# Altium schematic sheet MCU.SchDoc
size A4
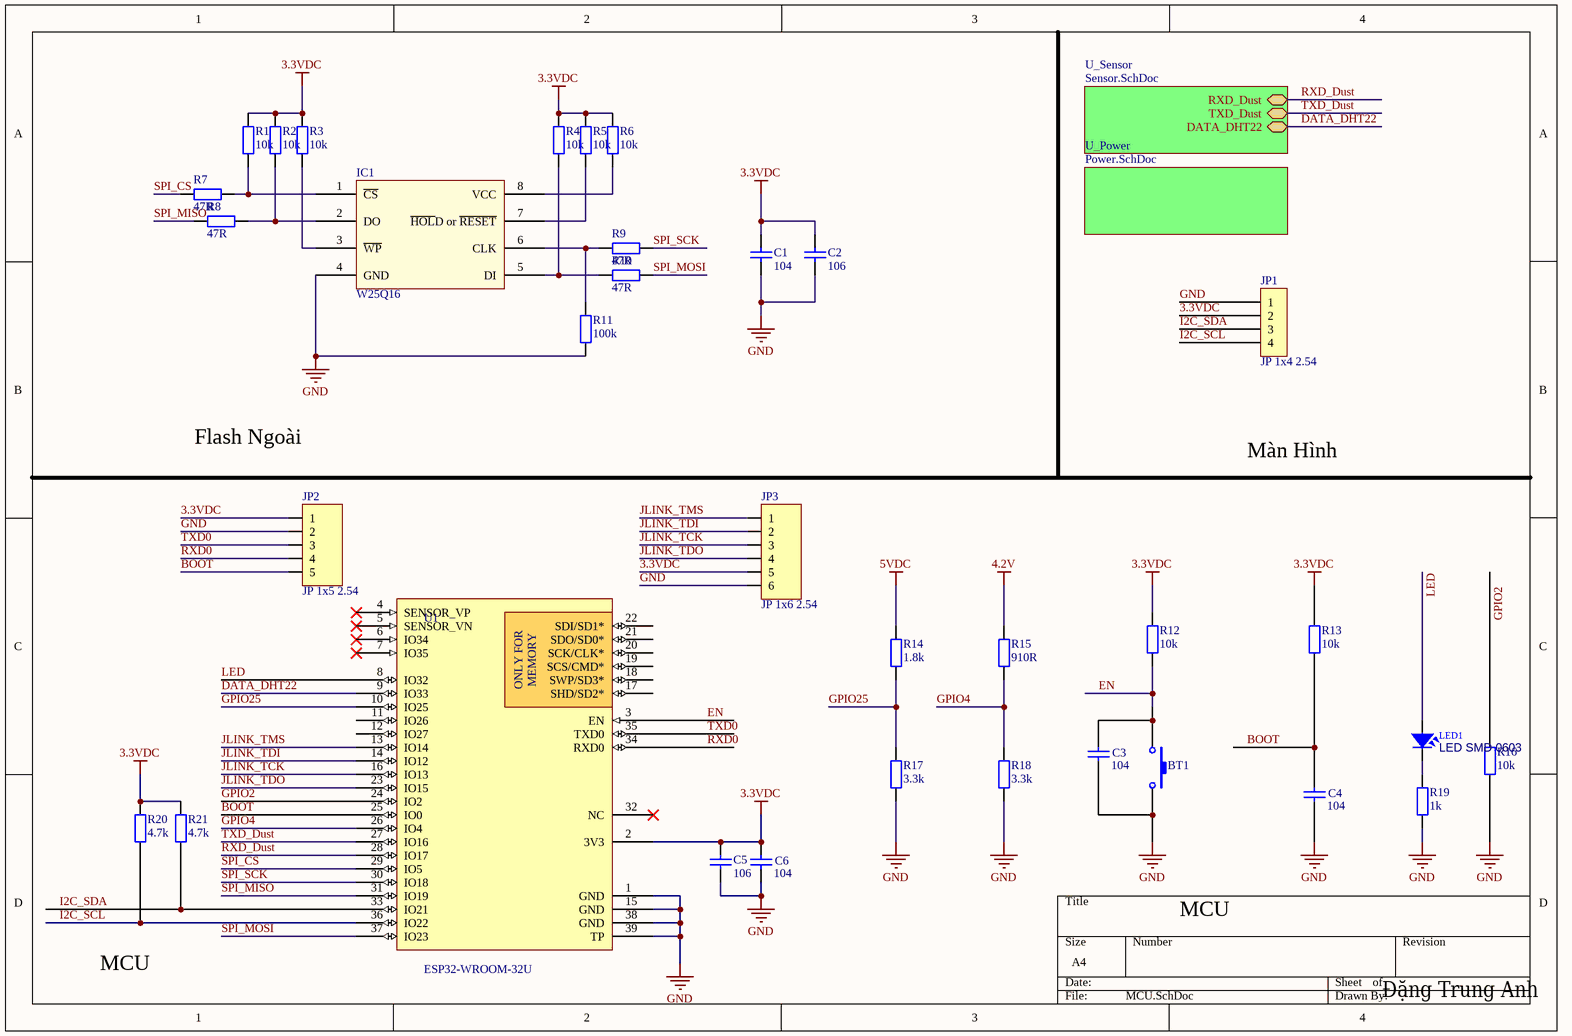
[diagram p0: MCU.SchDoc]

## Parts
BT1  Nut Nhan 2 Chan SMD 3x6x2.5  [Nut Nhan 2 Chan SMD 3x6x2.5]  (value not drawn)
C1  104  [tu 0603]
C2  106  [tu 0603]
C3  104  [tu 0603]
C4  104  [tu 0603]
C5  106  [tu 0603]
C6  104  [tu 0603]
IC1  W25Q16  [W25Q16 -SOIC8]
JP1  JP 1x4 2.54  [JP 1x4 DT]
JP2  JP 1x5 2.54  [JP 1x5 DT]
JP3  JP 1x6 2.54  [JP 1x6 DT]
LED1  LED SMD 0603  [LED-0603-BLUE]
R1  10k  [tro smd 0603]
R2  10k  [tro smd 0603]
R3  10k  [tro smd 0603]
R4  10k  [tro smd 0603]
R5  10k  [tro smd 0603]
R6  10k  [tro smd 0603]
R7  47R  [tro smd 0603]
R8  47R  [tro smd 0603]
R9  47R  [tro smd 0603]
R10  47R  [tro smd 0603]
R11  100k  [tro smd 0603]
R12  10k  [tro smd 0603]
R13  10k  [tro smd 0603]
R14  1.8k  [tro smd 0603]
R15  910R  [tro smd 0603]
R16  10k  [tro smd 0603]
R17  3.3k  [tro smd 0603]
R18  3.3k  [tro smd 0603]
R19  1k  [tro smd 0603]
R20  4.7k  [tro smd 0603]
R21  4.7k  [tro smd 0603]
U1  ESP32-WROOM-32U  [ESP32-WROOM-32]

## Sub-sheets
U_Power = Power.SchDoc: no entries
U_Sensor = Sensor.SchDoc: RXD_Dust (bidir), TXD_Dust (bidir), DATA_DHT22 (bidir)

## Nets
3.3VDC: C1.1 C2.1 C5.1 C6.1 JP1.2 JP2.1 JP3.5 R1.2 R2.2 R3.2 R4.2 R5.2 R6.2 R12.2 R13.2 R20.2 R21.2 U1.2(3V3)
4.2V: R15.2
5VDC: R14.2
GND: BT1.2 C1.2 C2.2 C3.2 C4.2 C5.2 C6.2 IC1.4(GND) JP1.1 JP2.2 JP3.6 R11.1 R16.1 R17.1 R18.1 R19.1 U1.1(GND) U1.15(GND) U1.38(GND) U1.39(TP)
BOOT: C4.1 JP2.5 R13.1 U1.25(IO0)
DATA_DHT22: U1.9(IO33) ; sheet U_Sensor/DATA_DHT22
EN: BT1.1 C3.1 R12.1 U1.3(EN)
GPIO2: R16.2 U1.24(IO2)
GPIO4: R15.1 R18.2 U1.26(IO4)
GPIO25: R14.1 R17.2 U1.10(IO25)
I2C_SCL: JP1.4 R20.1 U1.36(IO22)
I2C_SDA: JP1.3 R21.1 U1.33(IO21)
JLINK_TCK: JP3.3 U1.16(IO13)
JLINK_TDI: JP3.2 U1.14(IO12)
JLINK_TDO: JP3.4 U1.23(IO15)
JLINK_TMS: JP3.1 U1.13(IO14)
LED: LED1.A U1.8(IO32)
RXD0: JP2.4 U1.34(RXD0)
RXD_Dust: U1.28(IO17) ; sheet U_Sensor/RXD_Dust
SPI_CS: R7.1 U1.29(IO5)
SPI_MISO: R8.1 U1.31(IO19)
SPI_MOSI: R10.2 U1.37(IO23)
SPI_SCK: R9.2 U1.30(IO18)
TXD0: JP2.3 U1.35(TXD0)
TXD_Dust: U1.27(IO16) ; sheet U_Sensor/TXD_Dust
NetIC1_1: IC1.1(~{CS}) R1.1 R7.2
NetIC1_2: IC1.2(DO) R2.1 R8.2
NetIC1_3: IC1.3(~{WP}) R3.1
NetIC1_5: IC1.5(DI) R4.1 R10.1
NetIC1_6: IC1.6(CLK) R9.1 R11.2
NetIC1_7: IC1.7(~{HOL}D_or_~{RESET}) R5.1
NetIC1_8: IC1.8(VCC) R6.1
NetLED1_K: LED1.K R19.2

Not connected (* = marked no-connect by the designer): U1 4(SENSOR_VP)* 5(SENSOR_VN)* 6(IO34)* 7(IO35)* 11(IO26) 12(IO27) 17(SHD/SD2*) 18(SWP/SD3*) 19(SCS/CMD*) 20(SCK/CLK*) 21(SDO/SD0*) 22(SDI/SD1*) 32(NC)*

## Notes on the sheet
- Flash Ngoài
- Màn Hình
- MCU
- Đặng Trung Anh
- (in symbol ESP32-WROOM-32U) ONLY FOR; MEMORY

## Library data of the parts
BT1 = Nut Nhan 2 Chan SMD 3x6x2.5: Ma_Hang: MH001036; Ten: Nút Nhấn 2 Chân 3x6x2.5MM SMD
C1 C3 C4 C6 = Tu 0603 104 50V 10%: Dán; Don_Vi: Con; So_Chan: 2; Ten_Linh_Kien: Tụ 0603 104-100nF 10% 50V; Ma_Hang: MH004568; Chung_Loai: Dán; Kieu_Chan: *
C2 C5 = Tu 0603 106 16V 20%: Dán; Don_Vi: Con; So_Chan: 2; Ten_Linh_Kien: Tụ 0603-10uF 20% 16V; Ma_Hang: MH004848; Chung_Loai: Dán; Kieu_Chan: *
JP1 = JP 1x4 2.54 Duc Thang: Cắm; Ten_Linh_Kien: Jump Đơn Đực 2.54MM 1x40P Thẳng 11MM; Don_Vi: Con; Ma_Hang: MH000903; Ghi_Chu: *; Kieu_Chan: *; Chung_Loai: Cắm
JP2 = JP 1x5 2.54 Duc Thang: Cắm; Ten_Linh_Kien: Jump Đơn Đực 2.54MM 1x40P Thẳng 11MM; Don_Vi: Con; Ma_Hang: MH000903; Ghi_Chu: *; Kieu_Chan: *; Chung_Loai: Cắm
JP3 = JP 1x6 2.54 Duc Thang: Cắm; Ten_Linh_Kien: Jump Đơn Đực 2.54MM 1x40P Thẳng 11MM; Don_Vi: Con; Ma_Hang: MH000903; Ghi_Chu: *; Kieu_Chan: *; Chung_Loai: Cắm
LED1 = LED SMD 0603: LED 0603 SMD Green 525nm 350mcd 20mA; Manufacturer 1: Kingbright; Manufacturer Part Number 1: APT1608ZGCK; Material: InGaN; Ratings: 200mcd min; 350 mcd typ @ 20mA; Voltage - Forward (Vf) @ 10mA: 3.1V; Viewing Angle: 120°; Lens Style/Size: Rectangle with Flat Top, 1.2mm x 0.8mm; Voltage - Forward (Vf) @ 20mA: 3.3V; SCDType: source; Package / Case: 0603 (1608 metric); Color: Green; Current - Test: 20mA; Manufacturer 2: Kingbright Company LLC; Manufacturer Part Number 2: APT1608-WAP24; Supplier 1: Mouser; Supplier Part Number 1: 604-APT1608ZGCK; ComponentLink1URL: http://www.mouser.com/ds/2/216/APT1608ZGCK-262051.pdf; ComponentLink1Description: http://www.mouser.com/ds/2/216/APT1608ZGCK-262051.pdf; ComponentLink2Description: APT1608-WAP24 Datasheet; ComponentLink2URL: \\SVFI2\PBLShare\Eng\Electrical Engineering\Hardware\Altium\Libraries and Templates\Unreleased Components\Part Number Request 2013-10-02\APT1608-WAP24(Ver.1B).pdf
R1-R6 R12 R13 R16 = Tro 0603 1% 10k: Dán; Don_Vi: Con; So_Chan: 2; Ten_Linh_Kien: Trở 0603 1% 10k; Ma_Hang: MH006333; Chung_Loai: Dán; Kieu_Chan: *
R7-R10 = Tro 0603 1% 47R: Dán; Don_Vi: Con; So_Chan: 2; Ten_Linh_Kien: Trở 0603 1% 0R; Ma_Hang: MH005792; Chung_Loai: Dán; Kieu_Chan: *
R11 = Tro 0603 5% 100k: Dán; So_Chan: 2; Ten_Linh_Kien: Trở 0603 5% 100k; Ma_Hang: MH006314; Don_Vi: Con; Chung_Loai: Dán; Kieu_Chan: *
R14 = Tro 0603 1% 1.8k: Dán; Don_Vi: Con; So_Chan: 2; Ten_Linh_Kien: Trở 0603 1% 0R; Ma_Hang: MH005792; Chung_Loai: Dán; Kieu_Chan: *
R15 = Tro 0603 1% 910R: Dán; Don_Vi: Con; So_Chan: 2; Ten_Linh_Kien: Trở 0603 1% 0R; Ma_Hang: MH005792; Chung_Loai: Dán; Kieu_Chan: *
R17 R18 = Tro 0603 5% 3.3k: Dán; Don_Vi: Con; So_Chan: 2; Ten_Linh_Kien: Trở 0603 5% 3.3k; Ma_Hang: MH006332; Chung_Loai: Dán; Kieu_Chan: *
R19 = Tro 0603 5% 1k: Dán; Don_Vi: Con; So_Chan: 2; Ten_Linh_Kien: Trở 0603 5% 1k; Ma_Hang: MH006319; Chung_Loai: Dán; Kieu_Chan: *
R20 R21 = Tro 0603 5% 4.7k: Dán; Don_Vi: Con; So_Chan: 2; Ten_Linh_Kien: Trở 0603 5% 4.7k; Ma_Hang: MH006327; Chung_Loai: Dán; Kieu_Chan: *
U1 = ESP32-WROOM-32U: Wi-Fi/BT BLE Module ESP32-D0WD; MFR: Espressif; Solder: SMT; Price: None; Value: ESP32-WROOM-32U; Category: MODULE; MPN: ESP32-WROOM-32U; PinCount: 40